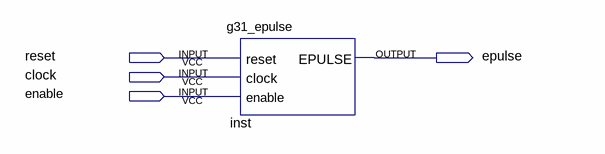
[diagram p0: schematic sheet]
// Quartus schematic g31_epulse_circuit.bdf as structural Verilog: 1 symbols, 4 pins
module g31_epulse_circuit (
  input  reset,
  input  clock,
  input  enable,
  output epulse
);

  g31_epulse inst (.reset(reset), .clock(clock), .enable(enable), .EPULSE(epulse));
endmodule
